# Altium schematic sheet 1_p0_core.schdoc
size 307 x 218 mm; Symbol: Sheet-Symbol_A4; Device: Sheet-Symbol_A4; @Project Name: ai_camera; @Page Count: 5; @Update Date: 2026-03-17; @Create Date: 2026-03-09; @Schematic Name: Schematic1; @Page No: 1; @Page Name: p0_core; @Board Name: Board1; Company: 嘉立创EDA; Version: V1.0; Page Size: A4; Convert to PCB: yes; Add into BOM: yes; Title Block Position: 3; Width: 1170; Height: 825; Region Start: 1; X Region Count: 6; Y Region Count: 4; Blade Width: 10; @Create Time: 03:38:01; @Update Time: 10:36:46
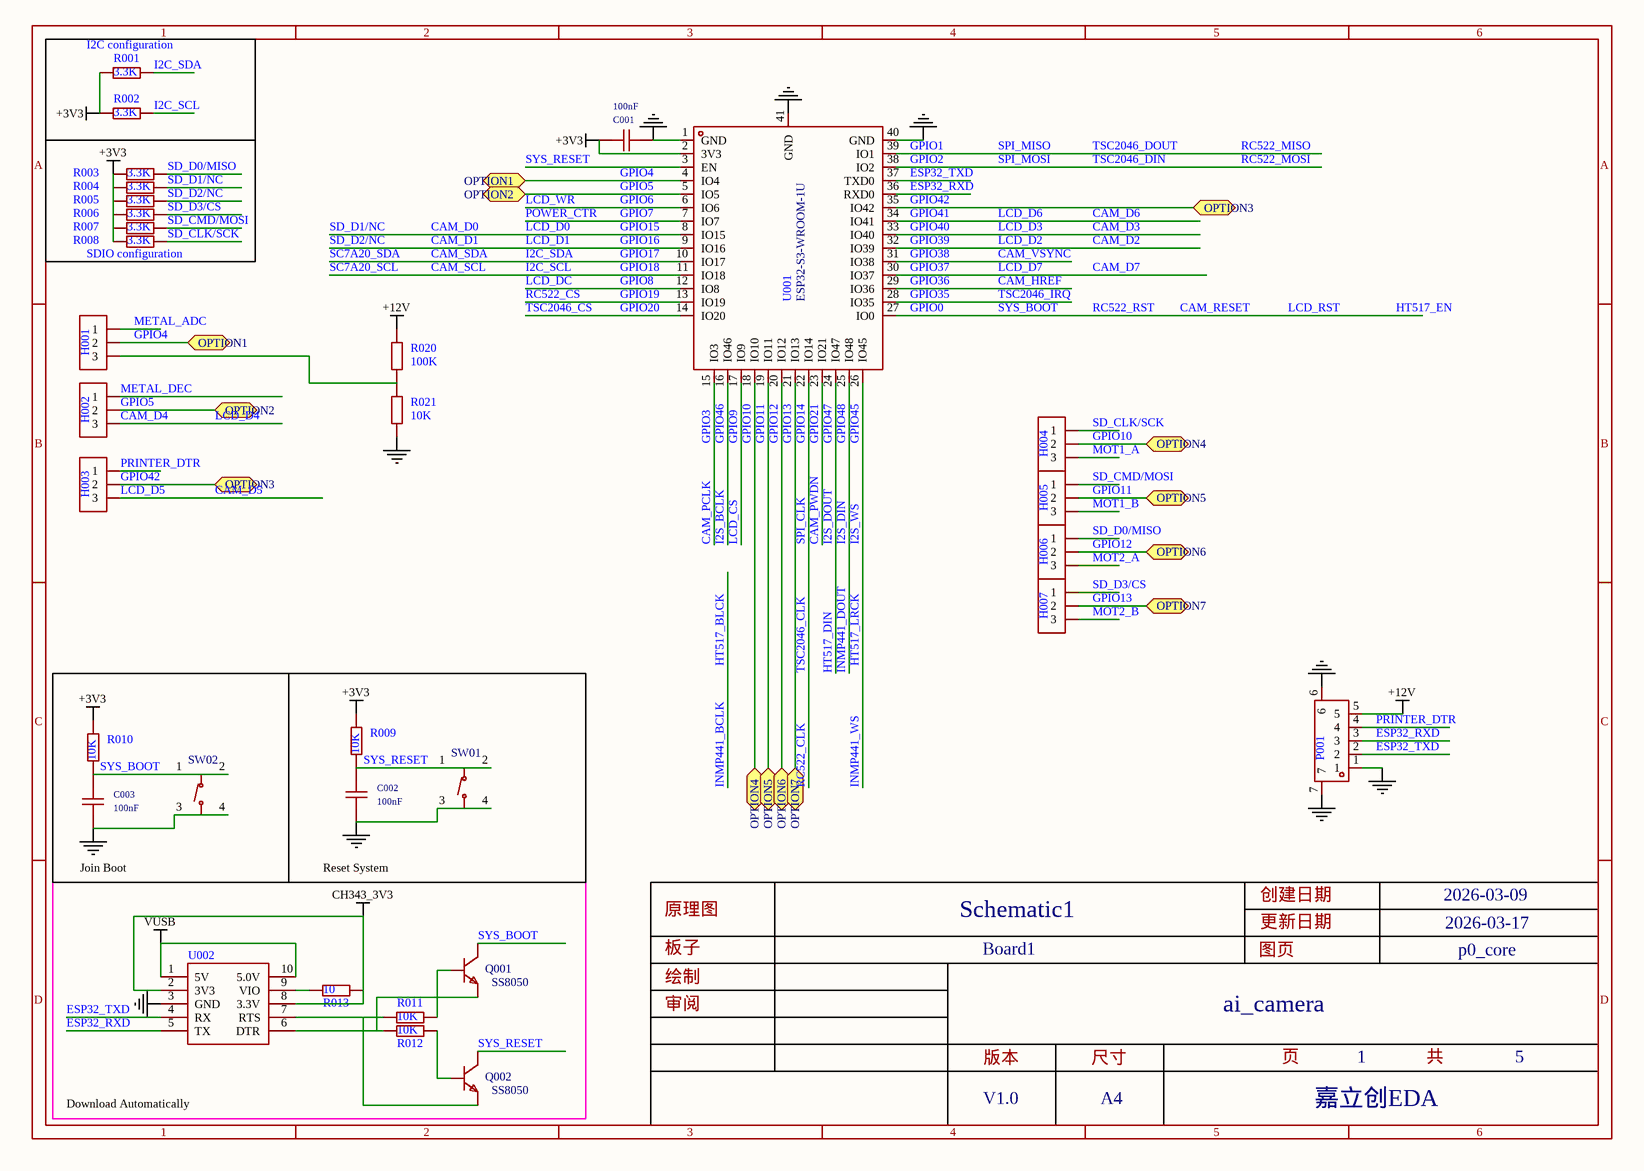
[diagram p0: 1_p0_core.schdoc]

## Parts
C001  100nF  [C0603]
C002  100nF  [C0603]
C003  100nF  [C0603]
H001  2.54-1*3P针  [HDR-TH_3P-P2.54-V-M-1]  (value not drawn)
H002  2.54-1*3P针  [HDR-TH_3P-P2.54-V-M-1]  (value not drawn)
H003  2.54-1*3P针  [HDR-TH_3P-P2.54-V-M-1]  (value not drawn)
H004  2.54-1*3P针  [HDR-TH_3P-P2.54-V-M-1]  (value not drawn)
H005  2.54-1*3P针  [HDR-TH_3P-P2.54-V-M-1]  (value not drawn)
H006  2.54-1*3P针  [HDR-TH_3P-P2.54-V-M-1]  (value not drawn)
H007  2.54-1*3P针  [HDR-TH_3P-P2.54-V-M-1]  (value not drawn)
P001  HX20007-5AWB  [CONN-SMD_5P-P2.00_HX20007-5AWB]  (value not drawn)
Q001  SS8050  [SOT-23-3_L2.9-W1.3-P1.90-LS2.4-BR]
Q002  SS8050  [SOT-23-3_L2.9-W1.3-P1.90-LS2.4-BR]
R001  3.3K  [R0603]
R002  3.3K  [R0603]
R003  3.3K  [R0603]
R004  3.3K  [R0603]
R005  3.3K  [R0603]
R006  3.3K  [R0603]
R007  3.3K  [R0603]
R008  3.3K  [R0603]
R009  10K  [R0603]
R010  10K  [R0603]
R011  10K  [R0603]
R012  10K  [R0603]
R013  10  [R0603]
R020  100K  [R0603]
R021  10K  [R0603]
SW01  TS-1187A-B-A-B  [SW-SMD_4P-L5.1-W5.1-P3.70-LS6.5-TL-2]  (value not drawn)
SW02  TS-1187A-B-A-B  [SW-SMD_4P-L5.1-W5.1-P3.70-LS6.5-TL-2]  (value not drawn)
U001  (no value)  [ESP32-S3-WROOM-1U]
U002  (no value)  [CH343_Module_Mini]

## Blocks framed on the sheet
I2C configuration: R001 R002
SDIO configuration: R003 R004 R005 R006 R007 R008
Join Boot: C003 R010 SW02
Reset System: C002 R009 SW01
Download Automatically: Q001 Q002 R011 R012 R013 U002

## Ports
OPTION1 (bidir), OPTION2 (bidir), OPTION3 (bidir), OPTION4 (bidir), OPTION5 (bidir), OPTION6 (bidir), OPTION7 (bidir)

## Nets
+3V3: C001.2 R001.1 R002.1 R003.1 R004.1 R005.1 R006.1 R007.1 R008.1 R009.2 R010.2 U001.2(3V3)
+12V: P001.5 R020.1
CH343_3V3: R013.1 U002.2(3V3) U002.8(3.3V)
GND: C001.1 C002.2 C003.2 P001.1 P001.6 P001.7 R021.2 SW01.3(C) SW01.4(D) SW02.3(C) SW02.4(D) U001.1(GND) U001.40(GND) U001.41(GND) U002.3(GND)
VUSB: U002.1(5V) U002.10(5.0V)
CAM_D0: R004.2 U001.8(IO15)  [also labelled GPIO15, LCD_D0, SD_D1/NC]
CAM_D1: R005.2 U001.9(IO16)  [also labelled GPIO16, LCD_D1, SD_D2/NC]
CAM_D2: U001.32(IO39)  [also labelled GPIO39, LCD_D2]
CAM_D3: U001.33(IO40)  [also labelled GPIO40, LCD_D3]
CAM_D4: H002.3  [also labelled LCD_D4]
CAM_D5: H003.3  [also labelled LCD_D5]
CAM_D6: U001.34(IO41)  [also labelled GPIO41, LCD_D6]
CAM_D7: U001.30(IO37)  [also labelled GPIO37, LCD_D7]
CAM_HREF: U001.29(IO36)  [also labelled GPIO36]
CAM_PCLK: U001.15(IO3)  [also labelled GPIO3]
CAM_PWDN: U001.23(IO21)  [also labelled GPIO21]
CAM_RESET: C003.1 Q001.3(C) R010.1 SW02.1(A) SW02.2(B) U001.27(IO0)  [also labelled GPIO0, HT517_EN, LCD_RST, RC522_RST, SYS_BOOT]
CAM_SCL: R002.2 U001.11(IO18)  [also labelled GPIO18, I2C_SCL, SC7A20_SCL]
CAM_SDA: R001.2 U001.10(IO17)  [also labelled GPIO17, I2C_SDA, SC7A20_SDA]
CAM_VSYNC: U001.31(IO38)  [also labelled GPIO38]
ESP32_RXD: P001.3 U001.36(RXD0) U002.5(TX)
ESP32_TXD: P001.2 U001.37(TXD0) U002.4(RX)
GPIO1: U001.39(IO1)  [also labelled RC522_MISO, SPI_MISO, TSC2046_DOUT]
GPIO2: U001.38(IO2)  [also labelled RC522_MOSI, SPI_MOSI, TSC2046_DIN]
GPIO4: H001.2 U001.4(IO4) ; port OPTION1
GPIO5: H002.2 U001.5(IO5) ; port OPTION2
GPIO6: U001.6(IO6)  [also labelled LCD_WR]
GPIO7: U001.7(IO7)  [also labelled POWER_CTR]
GPIO8: U001.12(IO8)  [also labelled LCD_DC]
GPIO9: U001.17(IO9)  [also labelled LCD_CS]
GPIO10: H004.2 U001.18(IO10) ; port OPTION4
GPIO11: H005.2 U001.19(IO11) ; port OPTION5
GPIO12: H006.2 U001.20(IO12) ; port OPTION6
GPIO13: H007.2 U001.21(IO13) ; port OPTION7
GPIO14: U001.22(IO14)  [also labelled RC522_CLK, SPI_CLK, TSC2046_CLK]
GPIO19: U001.13(IO19)  [also labelled RC522_CS]
GPIO20: U001.14(IO20)  [also labelled TSC2046_CS]
GPIO35: U001.28(IO35)  [also labelled TSC2046_IRQ]
GPIO42: H003.2 U001.35(IO42) ; port OPTION3
GPIO45: U001.26(IO45)  [also labelled HT517_LRCK, I2S_WS, INMP441_WS]
GPIO46: U001.16(IO46)  [also labelled I2S_BCLK]
GPIO47: U001.24(IO47)  [also labelled HT517_DIN, I2S_DOUT]
GPIO48: U001.25(IO48)  [also labelled I2S_DIN, INMP441_DOUT]
METAL_ADC: H001.1
METAL_DEC: H002.1
MOT1_A: H004.3
MOT1_B: H005.3
MOT2_A: H006.3
MOT2_B: H007.3
PRINTER_DTR: H003.1 P001.4
SD_CLK/SCK: H004.1 R008.2
SD_CMD/MOSI: H005.1 R007.2
SD_D0/MISO: H006.1 R003.2
SD_D3/CS: H007.1 R006.2
SYS_RESET: C002.1 Q002.3(C) R009.1 SW01.1(A) SW01.2(B) U001.3(EN)
NetH001_3: H001.3 R020.2 R021.1
NetQ001_1: Q001.1(B) R011.1
NetQ001_2: Q001.2(E) R012.2 U002.6(DTR)
NetQ002_1: Q002.1(B) R012.1
NetQ002_2: Q002.2(E) R011.2 U002.7(RTS)
NetR013_2: R013.2 U002.9(VIO)

## Notes on the sheet
- 1
- 2
- 3
- 4
- 5
- 6
- A
- B
- C
- 原理图
- Schematic1
- 创建日期
- 更新日期
- 2026-03-09
- 2026-03-17
- 绘制
- 板子
- Board1
- 图页
- p0_core
- D
- 审阅
- 版本
- 尺寸
- ai_camera
- 页
- 共
- V1.0
- A4
- 嘉立创EDA

## Library data of the parts
C001 C002 C003 = CAP_0603: Symbol: CapAcitance; Convert to PCB: yes; Device: CAP_0603; Add into BOM: yes; Supplier Footprint: 0603; Value: 100nF
H001 H002 H003 H004 H005 H006 H007 = 2.54-1*3P针: Manufacturer: BOOMELE(博穆精密); Symbol: Header-Male-2.54_1x3; Add into BOM: yes; Pitch: 2.54mm; Pin Structure: 1x3P; Circluar Pins/Square Pins: 方针; Current Rating (Max): 3A; Device: 2.54-1*3P针; LCSC Part Name: 2.54mm 1x3P 直插 方针; Supplier Part: C49257; Manufacturer Part: 2.54-1*3P针; Supplier Footprint: 插件,P=2.54mm; JLCPCB Part Class: Extended Part; Datasheet: https://atta.szlcsc.com/upload/public/pdf/source/20151109/1457707570948.pdf; Supplier: LCSC; Convert to PCB: yes; Number of Pins: 3; Number of Rows: 1; Row Spacing: -; Mounting Type: 直插; Voltage Rating (Max): -; Length of Mating Pin: -; Insulation Height: -; Length of End Connection Pin: -; Contact Material: -; Contact Plating: -; Operating Temperature Range: -40℃~+105℃; Color: 黑色
P001 = HX20007-5AWB: Manufacturer: HX(红星); Add into BOM: yes; Reference Series: PH; Pitch: 2mm; Pins Structure: 1x5P; Number of PINs Per Row: 5; Gender: 公型插针; Symbol: HX20007-5AWB; Device: HX20007-5AWB; LCSC Part Name: 母座 卧贴 2.0mm 5Pin位 母座; Supplier Part: C442225; Manufacturer Part: HX20007-5AWB; Supplier Footprint: SMD,P=2mm; JLCPCB Part Class: Extended Part; Datasheet: https://atta.szlcsc.com/upload/public/pdf/source/20191028/C442225_DDD2455535F7EA1D3D205E5EFB10C902.pdf; Supplier: LCSC; Convert to PCB: yes; Number of Rows: 1; Row Spacing: -; Mounting Style: 卧贴; Current Rating (Max): -; Operating Temperature Range: -
Q001 Q002 = SS8050: Manufacturer: CJ（江苏长电/长晶）; Symbol: SS8050_C2150; Add into BOM: yes; Transistor Type: NPN; Collector-Emitter Breakdown Voltage (Vceo): 25V; Collector Current (Ic): 1.5A; Power Dissipation (Pd): 300mW; Collector-Emitter Saturation Voltage (VCE(sat)@Ic,Ib): 500mV@800mA,80mA; DC Current Gain (hFE@Ic,Vce): 200@100mA,1V; Transition Frequency (fT): 100MHz; Device: SS8050; LCSC Part Name: SS8050 Y1 200-350 Y1 200-350; Supplier Part: C2150; Manufacturer Part: SS8050; Supplier Footprint: SOT-23(SOT-23-3); JLCPCB Part Class: Basic Part; Datasheet: https://atta.szlcsc.com/upload/public/pdf/source/20140809/1457707209319.pdf; Supplier: LCSC; Convert to PCB: yes; Operating Temperature: +150℃@(Tj)
R001 R002 R003 R004 R005 R006 R007 R008 R013 R020 = Res_0603: Symbol: 电阻; Convert to PCB: yes; Value: 10K; Device: Res_0603; Add into BOM: yes; Supplier Footprint: 0603
R009 R010 R011 R012 R021 = Res_0603: Symbol: 电阻; Convert to PCB: yes; Device: Res_0603; Add into BOM: yes; Supplier Footprint: 0603; Value: 10K
SW01 SW02 = TS-1187A-B-A-B: Manufacturer: XKB Connectivity(中国星坤); Add into BOM: yes; Contact Current: 50mA; Voltage Rating (DC): 12V; Insulation Resistance: 100mΩ; Circuit: 单刀单掷; Actuator Style: 圆形按钮; Actuator/Cap Color: 金色; With Lamp: 无; Operating Force: 160gf; Mechanical Life: 100000; Switch Length: 5.1mm; Switch Height: 1.5mm; Strike Gundam: 否; Symbol: TS-1187A-B-A-B; Device: TS-1187A-B-A-B; LCSC Part Name: 5.1*5.1*1.5 防水金属头160gf; Supplier Part: C318884; Manufacturer Part: TS-1187A-B-A-B; Supplier Footprint: SMD; JLCPCB Part Class: Basic Part; Datasheet: https://atta.szlcsc.com/upload/public/pdf/source/20200227/C318884_1F20165719E1C4CAA3E10C4C359C6E26.pdf; Supplier: LCSC; Convert to PCB: yes; Mounting Style: 立贴; Operating Temperature: -30℃~+85℃; Switch Width: 5.1mm
U001 = ESP32-S3-WROOM-1U: Add into BOM: yes; Symbol: ESP32-S3-WROOM-1U; Device: ESP32-S3-WROOM-1U; Convert to PCB: yes
U002 = CH343_Module: Add into BOM: yes; Symbol: CH343_Module; Device: CH343_Module; Convert to PCB: yes